# EAGLE design main (EAGLE 9.0.1)
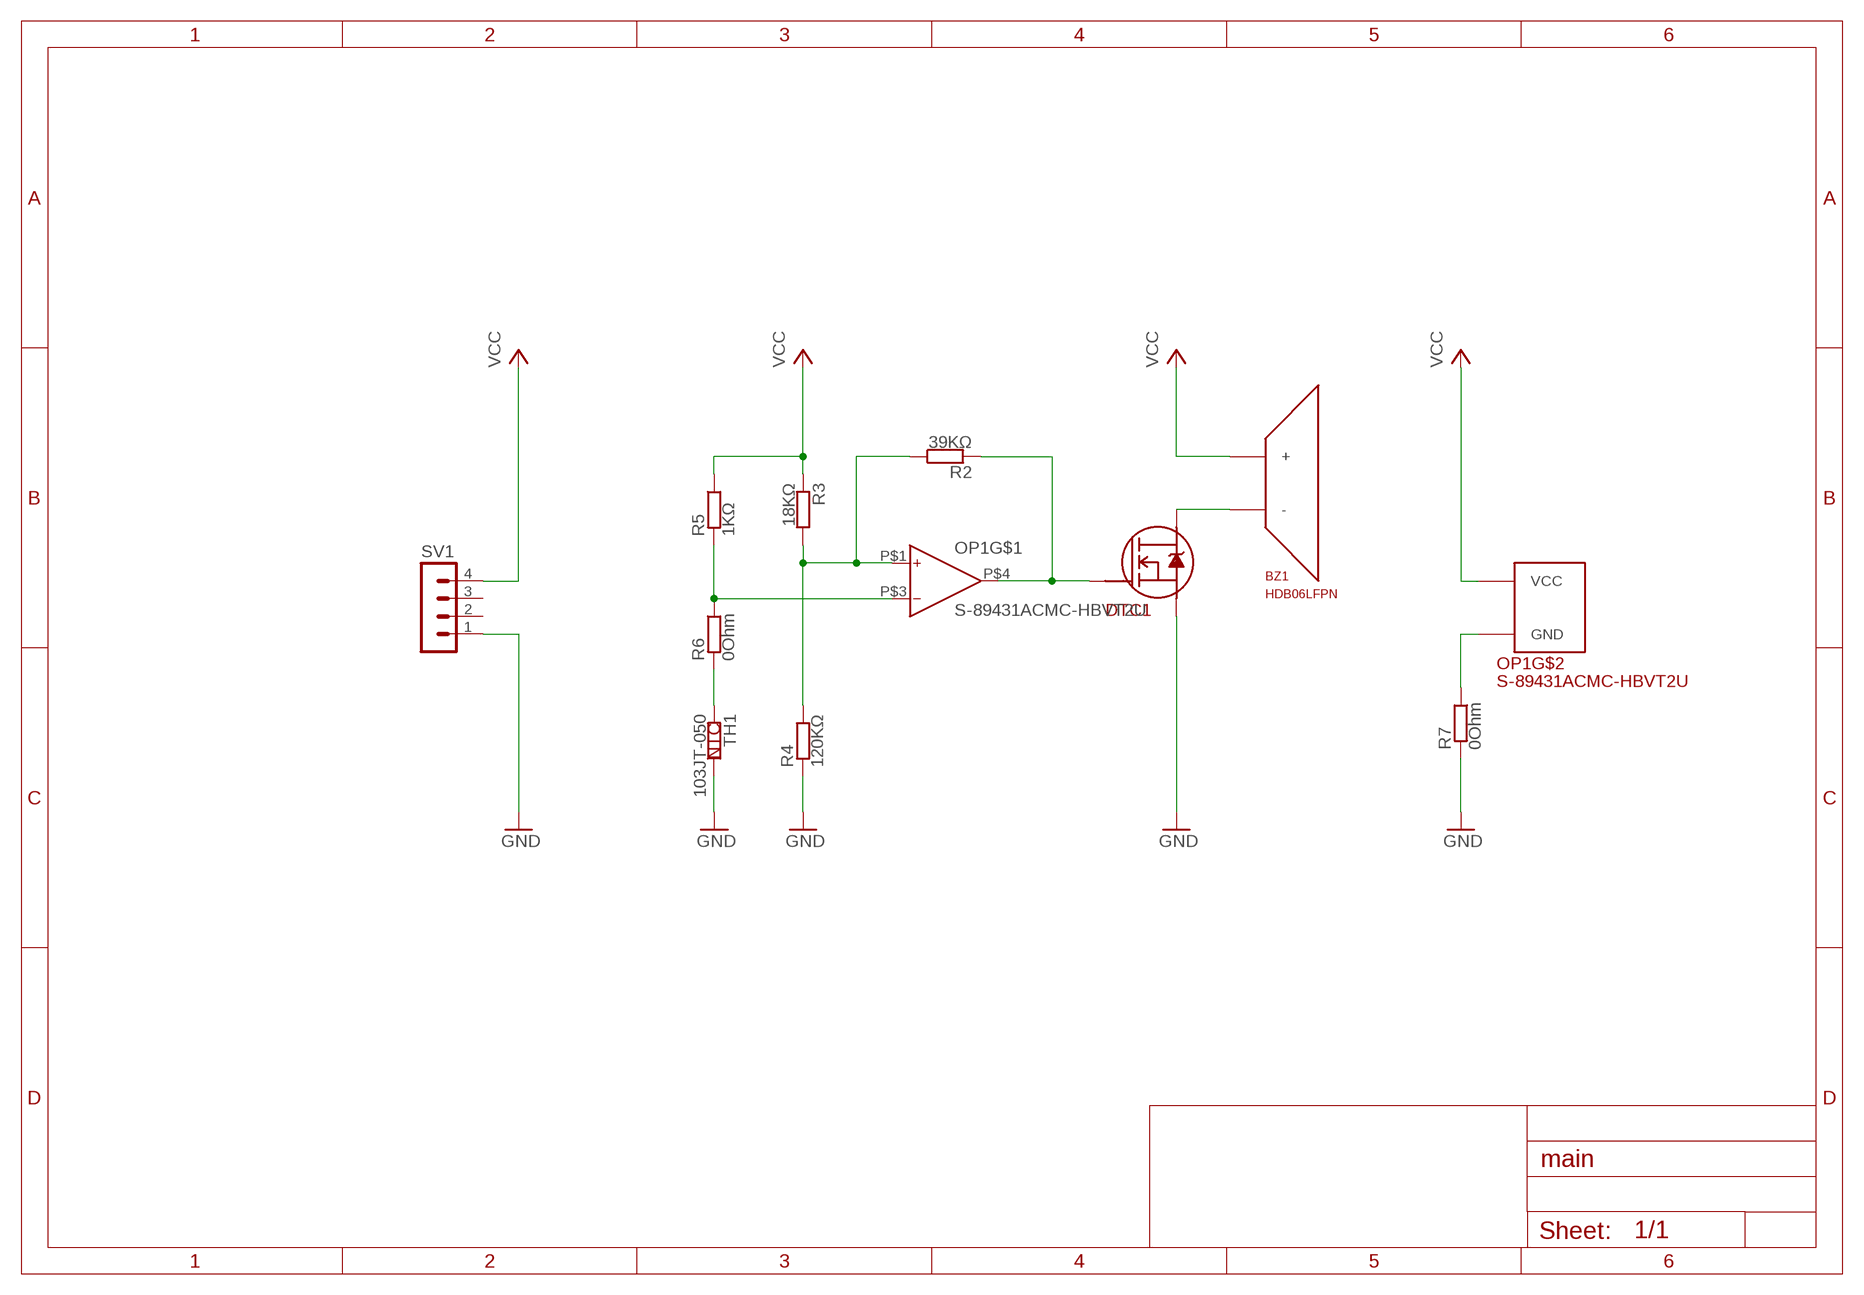
[diagram p0: schematic, sheet 1]

## Parts
BZ1  HDB06LFPN  [HDB06FLPN]
DTC1  RT1P137P  [SC-62]
OP1  S-89431ACMC-HBVT2U  [SOT-23-5]
R2  39KΩ  1/4W_RESISTER  [MF1/4]
R3  18KΩ  1/4W_RESISTER  [MF1/4]
R4  120KΩ  1/4W_RESISTER  [MF1/4]
R5  1KΩ  1/4W_RESISTER  [MF1/4]
R6  0Ohm  1/4W_RESISTER  [MF1/4]
R7  0Ohm  1/4W_RESISTER  [MF1/4]
SV1  MA04-1  [MA04-1]
TH1  103JT-050  [JT-W]

## Nets
GND: DTC1.E(S) R4.P$2 R7.P$2 SV1.1 TH1.P$1
N$1: DTC1.B(G) OP1.P$4(OUT) R2.P$2
N$2: OP1.P$3(IN-) R5.P$2 R6.P$1
N$4: BZ1.P$2(-) DTC1.C1(D) DTC1.C2(D)
N$5: R6.P$2 TH1.P$2
N$6: OP1.P$2(GND) R7.P$1
N$7: OP1.P$1(IN+) R2.P$1 R3.P$1 R4.P$1
VCC: BZ1.P$1(+) OP1.P$5(VCC) R3.P$2 R5.P$1 SV1.4
Unconnected: SV1.2 SV1.3

## Library data of the parts
BZ1 = BUzz:HDB06LFPN: 電子ブザー １６ｍｍ
DTC1 = Tr_EXT:RT1P137P
OP1 = SII:S-89431ACMC-HBVT2U: CMOS アンプ 1 回路 レール ツー レール SOT-23-5
R2-R7 = Tr_EXT:1/4W_RESISTER
SV1 = con-lstb:MA04-1: PIN HEADER; OC_FARNELL: unknown; OC_NEWARK: unknown
TH1 = SEMITEC:103JT-050

## Board
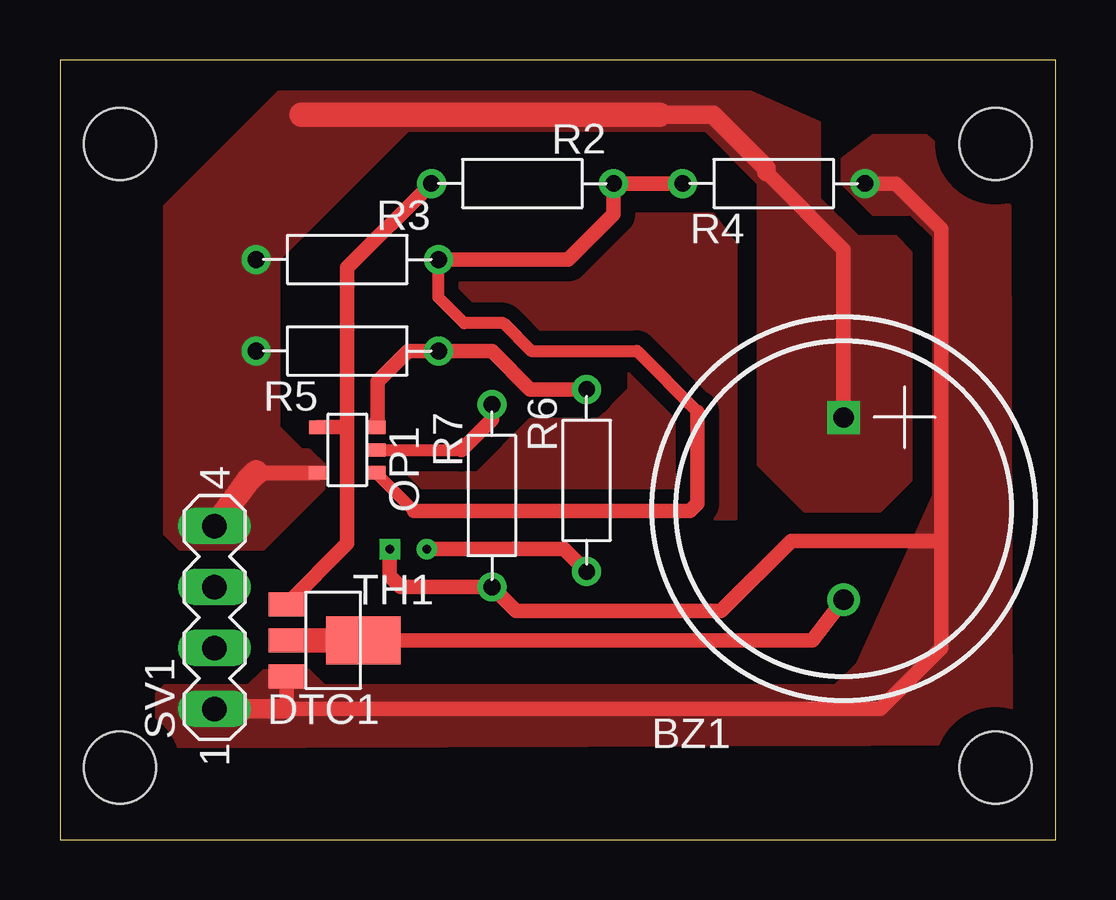
[diagram p1: board, top side]

Size 41.5 x 32.5 mm. Coordinates in mm from the lower left corner, seen from the top.
Outline: 0,0 41.5,0 41.5,32.5 0,32.5 0,0
Copper layers (1*16): Top 0.035mm / dielectric 1.5mm / Bottom 0.035mm
Design rules "default *": minimum track width 6mil, minimum drill 0.35mm, track to track 0.6mm, track to pad 0.6mm, pad to pad 0.6mm, via to via 0.6mm, smd to smd 0mil, copper to edge 40mil, drill to drill 6mil, minimum pad ring 10mil, minimum via ring 8mil, stop-mask expansion 4mil, vias tented up to drill 0mil, thermal gap 10mil
Holes 3 mm at 39,29 39,3 2.5,3 2.5,29

### Footprints (pad centres in the part's own frame; a part is rotated, then mirrored left to right if it is on the bottom)
HDB06FLPN = drill 0.85 square: P$1 -3.8,0 | drill 0.85: P$2 3.8,0
SC-62 = smd 1 x 1.5: B -1.5,0; C1 0,0; E 1.5,0 | smd 2 x 3.1: C2 0,3.2
SOT-23-5 = smd 0.55 x 0.8: P$1 -0.95,-1.2; P$2 0,-1.2; P$3 0.95,-1.2; P$4 0.95,1.2; P$5 -0.95,1.2
MF1/4 = drill 0.7: P$1 -3.8,0; P$2 3.8,0
MA04-1 = drill 1.016 long: 1 -3.81,0; 2 -1.27,0; 3 1.27,0; 4 3.81,0
JT-W = drill 0.35 square: P$1 -0.775,0 | drill 0.35: P$2 0.775,0

### Placement (x,y rotation side)
BZ1  32.66,13.79 270 top
DTC1  9.44,8.3 270 top
OP1  11.98,16.24 90 top
R2  19.28,27.35 180 top
R3  11.98,24.18 180 top
R4  29.76,27.35 0 top
R5  11.98,20.37 0 top
R6  21.95,14.97 270 top
R7  18.01,14.34 270 top
SV1  6.45,9.26 90 top
TH1  14.52,12.11 0 top

### Tracks (layer width: path | path; a pad name or v marks a point on that pad's centre or on a via)
GND
  Top 0.61: DTC1.E 9.44,5.45 34.2,5.45 36.74,7.99 36.74,12.45 | 36.74,12.45 36.74,25.45 34.84,27.35 R4.P$2 | TH1.P$1 13.74,10.98 14.19,10.54 R7.P$2 19.02,9.53 27.56,9.53 30.48,12.45 36.74,12.45
  Top 0.813: SV1.1 9.44,5.45
  pour Top (no thermals): 4.36,3.86 39.66,3.98 39.6,26.43 36.11,29.34 33.88,29.34 32.62,28.39 32.62,27.35 33.88,26.08 35.47,26.08 36.42,25.13 36.42,14.34 33.25,7.35 32.3,6.4 11.03,6.4 10.39,7.03 8.48,7.03 7.85,6.4 4.36,6.4 4.04,6.08 4.04,4.17
N$1
  Top 0.61: DTC1.B 11.98,12.34 11.98,17.19 | OP1.P$4 11.98,17.19 | R2.P$2 11.98,23.85 11.98,17.19
N$2
  Top 0.508: OP1.P$3 13.25,17.19
  Top 0.61: R6.P$1 19.6,18.77 18,20.37 R5.P$2 14.52,20.37 13.25,19.1 13.25,17.42 | 13.25,17.42 13.19,17.42 | OP1.P$3 13.25,17.26 13.25,17.42
N$3
  pour Top (no thermals): 23.09,26.08 27.22,26.08 28.17,24.81 28.17,13.38 14.2,13.38 12.93,14.65 12.93,15.29 17.38,15.29 19.6,17.51 22.45,17.51 23.73,18.78 23.73,19.73 23.41,20.05 19.91,20.05 18.33,21.64 16.11,21.64 15.47,22.27 15.47,22.59 16.11,23.86 20.23,23.86
N$4
  Top 0.152: DTC1.C2 12.61,8.3
  Top 0.61: DTC1.C2 31.36,8.3 BZ1.P$2
  Top 1.016: DTC1.C1 12.61,8.3
  Top 1.27: 12.92,8 12.61,8.3
N$5
  Top 0.61: TH1.P$2 21.01,12.11 R6.P$2
N$6
  Top 0.508: OP1.P$2 16.74,16.24
  Top 0.61: 16.74,16.24 18.01,17.51 R7.P$1
N$7
  Top 0.508: OP1.P$1 14.77,13.7 | R3.P$1 15.78,22.6 16.85,21.53 18.48,21.53 19.64,20.37 24.04,20.37 26.58,17.83
  Top 0.61: R3.P$1 21.18,24.18 23.08,26.07 R2.P$1 R4.P$1 | 26.58,17.83 26.58,14.02 26.27,13.7 14.77,13.7
VCC
  Top 0.61: OP1.P$5 8.17,15.29 7.85,14.97 | BZ1.P$1 32.66,24.59 29.44,27.81
  Top 0.762: 23.09,30.21 27.22,30.21 29.44,27.99 29.44,27.81
  Top 1.016: SV1.4 7.85,14.97 8.18,15.3 8.19,15.29 | 25,30.21 23.09,30.21 10.08,30.21
  pour Top (no thermals): 4.99,12.11 8.48,12.11 11.03,14.65 11.03,15.61 10.39,16.24 10.07,16.24 9.12,17.19 9.12,24.18 14.52,29.57 26.9,29.57 29.12,27.35 29.12,15.61 31.03,13.7 34.2,13.7 35.47,14.97 35.47,24.5 34.84,25.13 33.25,25.13 31.66,26.72 31.66,29.89 28.8,31.16 9.12,31.16 4.36,26.4 4.36,12.75